# Altium schematic sheet Ladder_ATTN.SchDoc
size A4; SheetNumber: 6; SheetTotal: 9
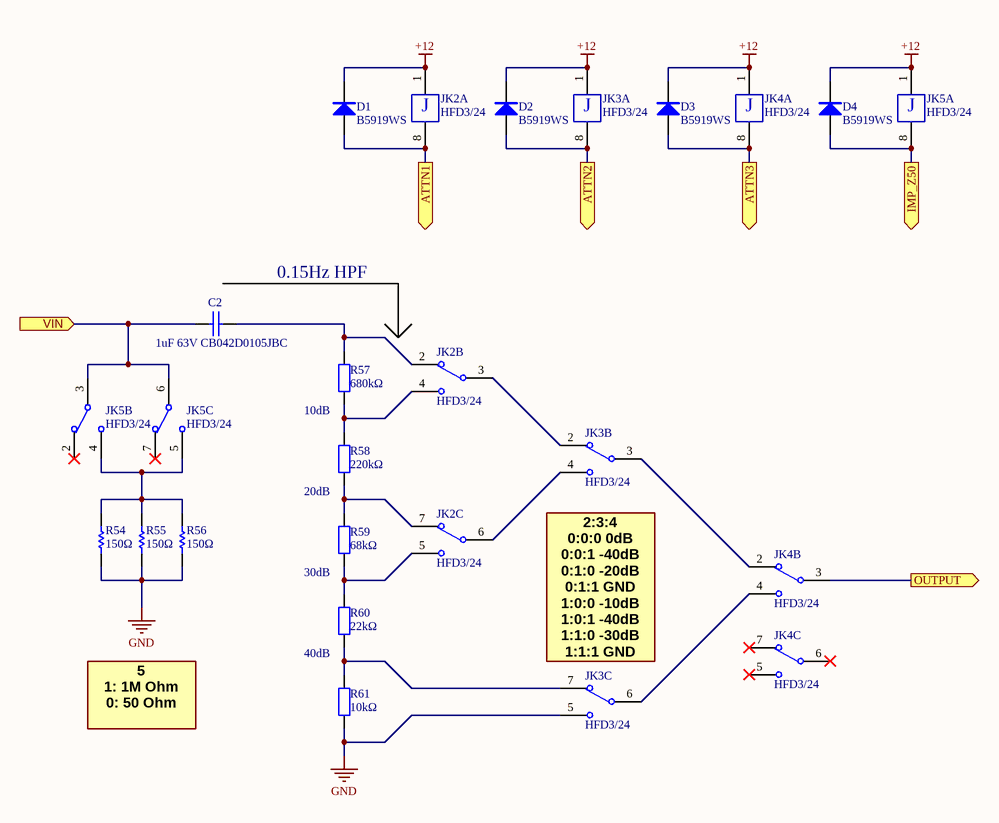
[diagram p0: Ladder_ATTN.SchDoc]

## Parts
C2  1uF 63V CB042D0105JBC  [2225C]
D1  B5919WS  [SOD-323]
D2  B5919WS  [SOD-323]
D3  B5919WS  [SOD-323]
D4  B5919WS  [SOD-323]
JK2  HFD3/24  [HFD3-DIP]  (parts A,B,C of 3)
JK3  HFD3/24  [HFD3-DIP]  (parts A,B,C of 3)
JK4  HFD3/24  [HFD3-DIP]  (parts A,B,C of 3)
JK5  HFD3/24  [HFD3-DIP]  (parts A,B,C of 3)
R54  150Ω  [2512R]
R55  150Ω  [2512R]
R56  150Ω  [2512R]
R57  680kΩ  [0603_R]
R58  220kΩ  [0603_R]
R59  68kΩ  [0603_R]
R60  22kΩ  [0603_R]
R61  10kΩ  [0603_R]

## Ports
ATTN1 (out), ATTN2 (out), ATTN3 (out), IMP_Z50 (out), OUTPUT (out), VIN (in)

## Nets
+12: D1.2(K) D2.2(K) D3.2(K) D4.2(K) JK2.1 JK3.1 JK4.1 JK5.1
GND: JK3.5 R54.1 R55.1 R56.1 R61.1
ATTN1: D1.1(A) JK2.8 ; port ATTN1
ATTN2: D2.1(A) JK3.8 ; port ATTN2
ATTN3: D3.1(A) JK4.8 ; port ATTN3
IMP_Z50: D4.1(A) JK5.8 ; port IMP_Z50
OUTPUT: JK4.3 ; port OUTPUT
VIN: C2.1 JK5.3 JK5.6 ; port VIN
NetC2_2: C2.2 JK2.2 R57.2
NetJK2_3: JK2.3 JK3.2
NetJK2_4: JK2.4 R57.1 R58.2
NetJK2_5: JK2.5 R59.1 R60.2
NetJK2_6: JK2.6 JK3.4
NetJK2_7: JK2.7 R58.1 R59.2
NetJK3_3: JK3.3 JK4.2
NetJK3_6: JK3.6 JK4.4
NetJK3_7: JK3.7 R60.1 R61.2
NetJK5_4: JK5.4 JK5.5 R54.2 R55.2 R56.2

Not connected (* = marked no-connect by the designer): JK4 5* 6* 7*; JK5 2* 7*

## Notes on the sheet
- 0.15Hz HPF
- 10dB
- 20dB
- 30dB
- 40dB
- (near JK3) 2:3:4
  0:0:0 0dB
  0:0:1 -40dB
  0:1:0 -20dB
  0:1:1 GND
  1:0:0 -10dB
  1:0:1 -40dB
  1:1:0 -30dB
  1:1:1 GND
- 5
  1: 1M Ohm
  0: 50 Ohm
- (in symbol HFD3, part A) J

## Library data of the parts
C2 = CAP: 无极性电容
D1-D4 = 1N5819: 肖特基二极管; 版权归属: 源创客; 属性: 40V/2A; BOM名称: 肖特基二极管; 学习资源: www.ooocke.com
JK2-JK5 = HFD3: 超小型两组转换; BOM名称: 两组转换继电器; 版权归属: 源创客; 学习资源: www.ooocke.com
R54-R56 = RES
R57 R59 = 0603 680KΩ (6803) 1%: 贴片电阻; ComponentLink1Description: 供应商链接; ComponentLink1URL: http://www.szlcsc.com/product/details_26565.html; Package: 0603; Supplier: LC; SuppliersPartNumber: C25822
R58 R60 R61 = 0603 220KΩ (2203) 1%: 贴片电阻; ComponentLink1Description: 供应商链接; ComponentLink1URL: http://www.szlcsc.com/product/details_23688.html; Package: 0603; Supplier: LC; SuppliersPartNumber: C22961